# EAGLE design quant_v1_oshpark (EAGLE 9.0.0)
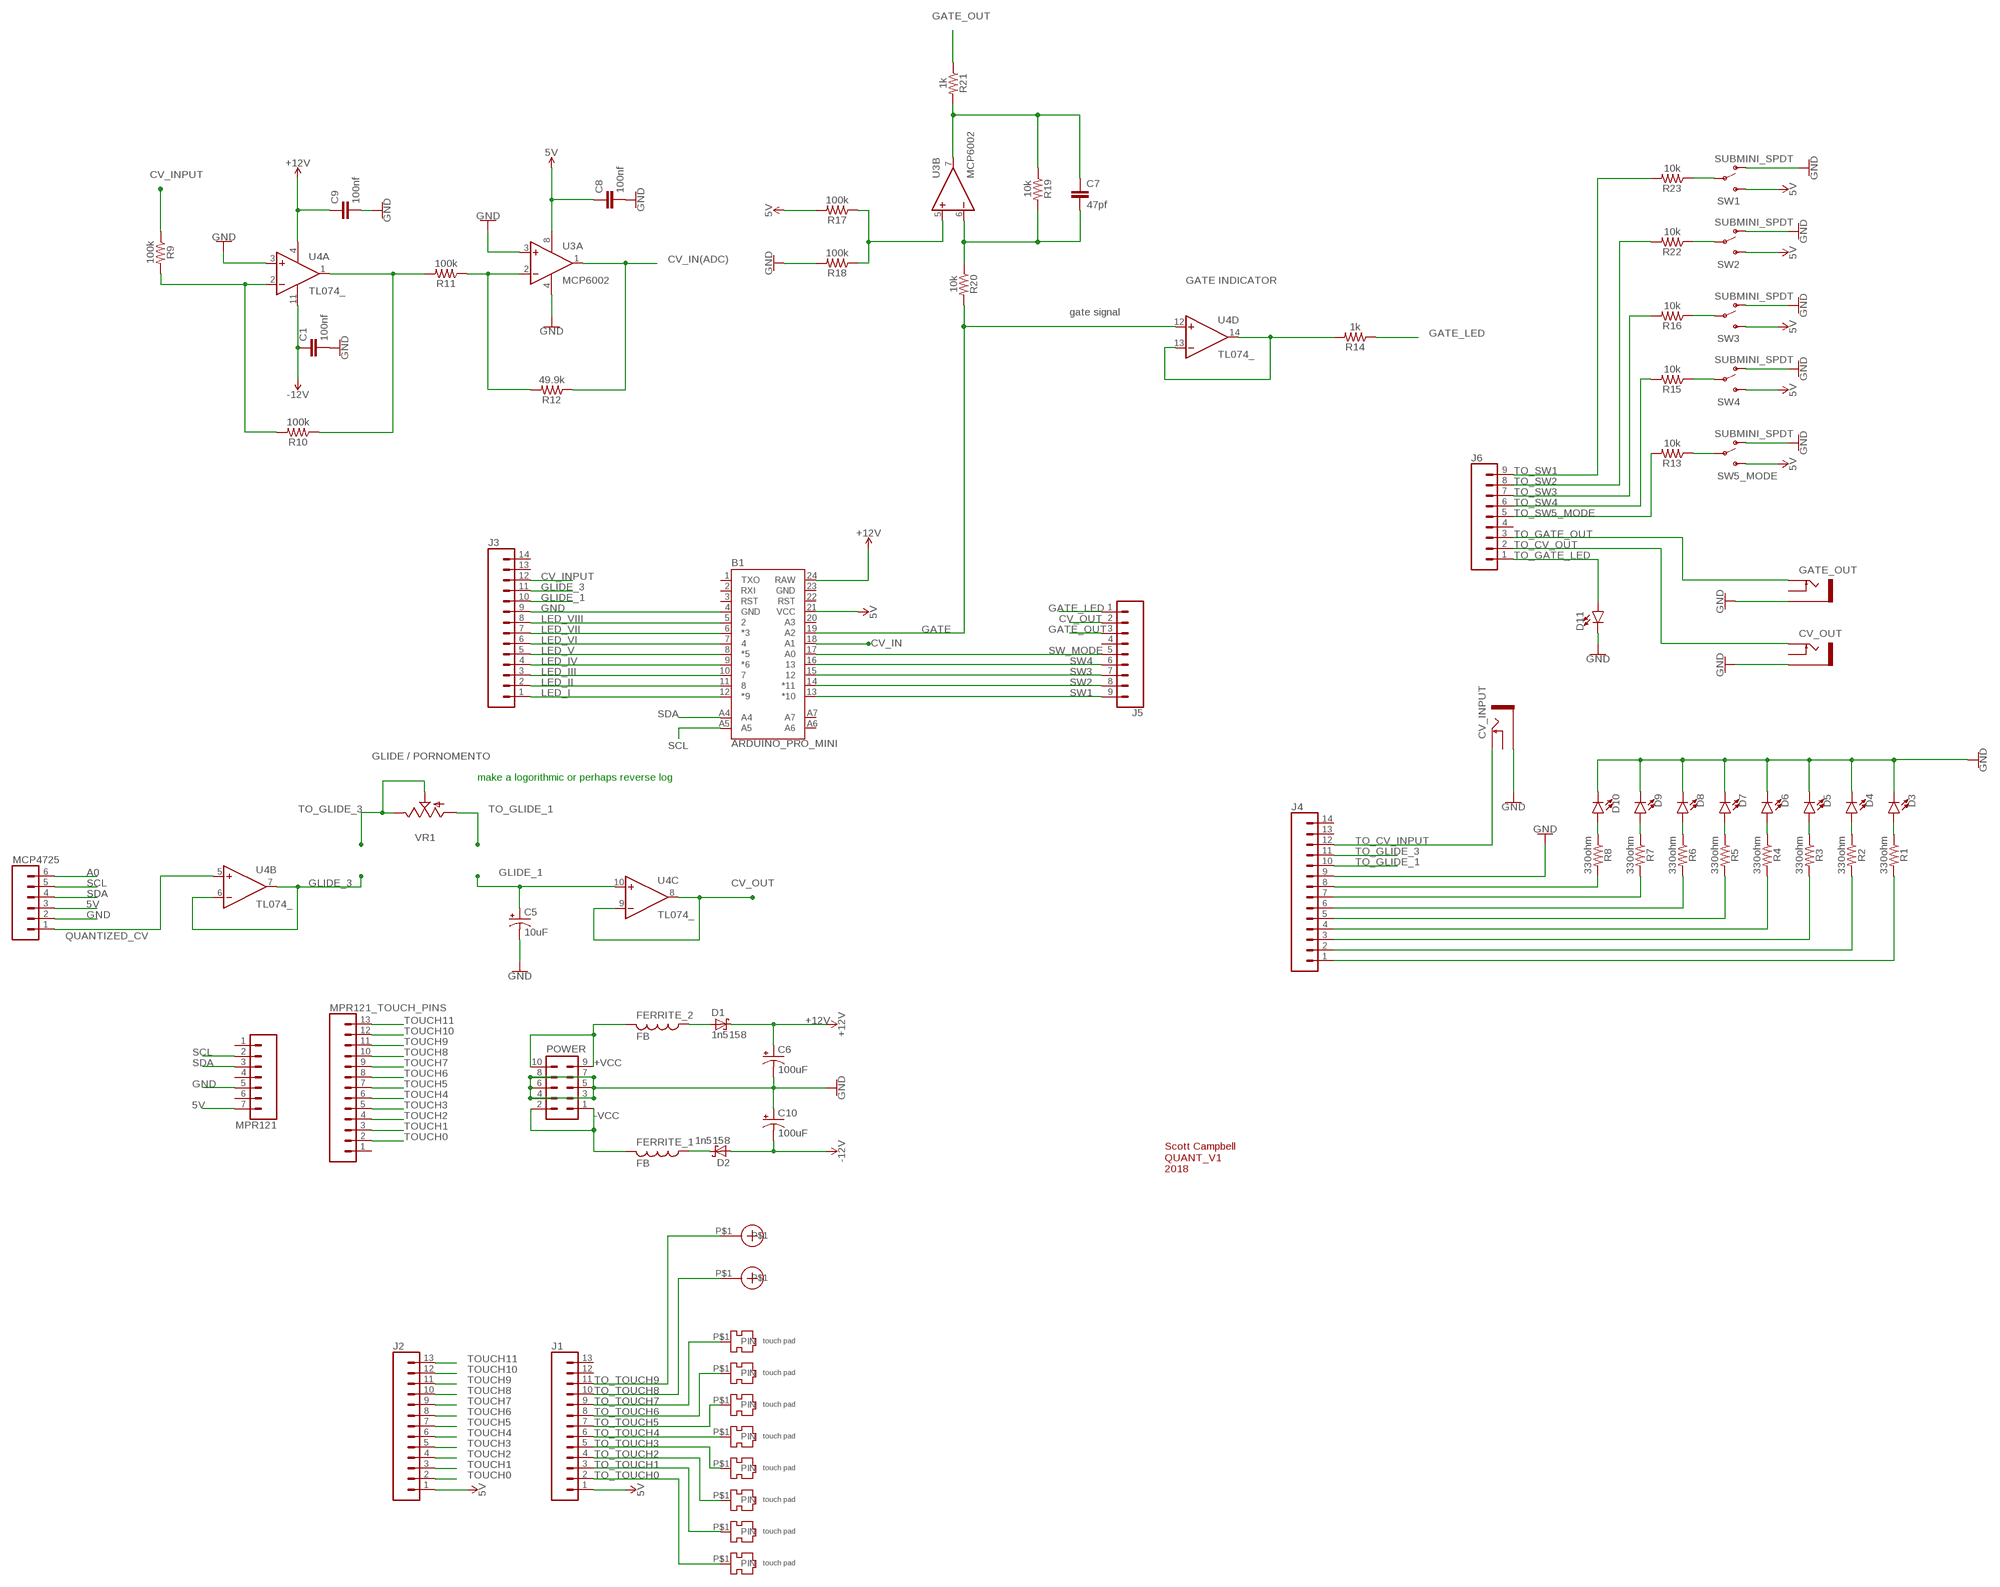
[diagram p0: schematic, sheet 1]

## Parts
B1  ARDUINO_PRO_MINI  [ARDUINO_PRO_MINI]
C1  100nf  C2.5/5  [C2.5-5]
C5  10uF  10UF-POLAR-RADIAL-2.5MM-25V-20%  [CPOL-RADIAL-2.5MM-5MM]
C6  100uF  100UF-POLAR-RADIAL-2.5MM-25V-20%  [CPOL-RADIAL-2.5MM-6.5MM]
C7  47pf  C2.5/5  [C2.5-5]
C8  100nf  C2,5-3  [C2.5-3]
C9  100nf  C2.5/5  [C2.5-5]
C10  100uF  100UF-POLAR-RADIAL-2.5MM-25V-20%  [CPOL-RADIAL-2.5MM-6.5MM]
CV_INPUT  THONKICONNNEW  [WQP-PJ301M-12_JACK]
CV_OUT  CV_OUT  THONKICONNNEW  [WQP-PJ301M-12_JACK]
D1  1n5158  SCHOTTKY-DIODEDO41  [DO41-10]
D2  1n5158  SCHOTTKY-DIODEDO41  [DO41-10]
D3  LED3MM  [LED_3MM]
D4  LED3MM  [LED_3MM]
D5  LED3MM  [LED_3MM]
D6  LED3MM  [LED_3MM]
D7  LED3MM  [LED_3MM]
D8  LED3MM  [LED_3MM]
D9  LED3MM  [LED_3MM]
D10  LED3MM  [LED_3MM]
D11  LED3MM  [LED_3MM]
FERRITE_1  FB  [FB]
FERRITE_2  FB  [FB]
GATE_OUT  GATE_OUT  THONKICONNNEW  [WQP-PJ301M-12_JACK]
J1  CONN_13  [1X13]
J2  CONN_13  [1X13]
J3  CONN_14  [1X14]
J4  CONN_14  [1X14]
J5  CONN_09  [1X09]
J6  CONN_09  [1X09]
MCP4725  CONN_06NO_SILK_FEMALE_PTH  [1X06_NO_SILK]
MPR121  CONN_07  [1X07]
MPR121_TOUCH_PINS  CONN_13  [1X13]
POWER  EURO_POWER_HEADERREGULAR  [EURO_POWER_HEADER]
R1  330ohm  1KOHM-HORIZ-1/4W-5%  [AXIAL-0.3]
R2  330ohm  1KOHM-HORIZ-1/4W-5%  [AXIAL-0.3]
R3  330ohm  1KOHM-HORIZ-1/4W-5%  [AXIAL-0.3]
R4  330ohm  1KOHM-HORIZ-1/4W-5%  [AXIAL-0.3]
R5  330ohm  1KOHM-HORIZ-1/4W-5%  [AXIAL-0.3]
R6  330ohm  1KOHM-HORIZ-1/4W-5%  [AXIAL-0.3]
R7  330ohm  1KOHM-HORIZ-1/4W-5%  [AXIAL-0.3]
R8  330ohm  1KOHM-HORIZ-1/4W-5%  [AXIAL-0.3]
R9  100k  1KOHM-HORIZ-1/4W-5%  [AXIAL-0.3]
R10  100k  1KOHM-HORIZ-1/4W-5%  [AXIAL-0.3]
R11  100k  1KOHM-HORIZ-1/4W-5%  [AXIAL-0.3]
R12  49.9k  1KOHM-HORIZ-1/4W-5%  [AXIAL-0.3]
R13  10k  1KOHM-HORIZ-1/4W-5%  [AXIAL-0.3]
R14  1k  1KOHM-HORIZ-1/4W-5%  [AXIAL-0.3]
R15  10k  1KOHM-HORIZ-1/4W-5%  [AXIAL-0.3]
R16  10k  1KOHM-HORIZ-1/4W-5%  [AXIAL-0.3]
R17  100k  1KOHM-HORIZ-1/4W-5%  [AXIAL-0.3]
R18  100k  1KOHM-HORIZ-1/4W-5%  [AXIAL-0.3]
R19  10k  1KOHM-HORIZ-1/4W-5%  [AXIAL-0.3]
R20  10k  1KOHM-HORIZ-1/4W-5%  [AXIAL-0.3]
R21  1k  1KOHM-HORIZ-1/4W-5%  [AXIAL-0.3]
R22  10k  1KOHM-HORIZ-1/4W-5%  [AXIAL-0.3]
R23  10k  1KOHM-HORIZ-1/4W-5%  [AXIAL-0.3]
SW1  SUBMINI_SPDT  [SUBMINI_TOGGLE]
SW2  SUBMINI_SPDT  [SUBMINI_TOGGLE]
SW3  SUBMINI_SPDT  [SUBMINI_TOGGLE]
SW4  SUBMINI_SPDT  [SUBMINI_TOGGLE]
SW5_MODE  SUBMINI_SPDT  [SUBMINI_TOGGLE]
TOUCH_1  TOUCH_PAD_ESSY  [TOUCH_PAD_ESSY]
TOUCH_2  TOUCH_PAD_ESSY  [TOUCH_PAD_ESSY]
TOUCH_3  TOUCH_PAD_ESSY  [TOUCH_PAD_ESSY]
TOUCH_4  TOUCH_PAD_ESSY  [TOUCH_PAD_ESSY]
TOUCH_5  TOUCH_PAD_ESSY  [TOUCH_PAD_ESSY]
TOUCH_6  TOUCH_PAD_ESSY  [TOUCH_PAD_ESSY]
TOUCH_7  TOUCH_PAD_ESSY  [TOUCH_PAD_ESSY]
TOUCH_8  TOUCH_PAD_ESSY  [TOUCH_PAD_ESSY]
U3  MCP6002  TL072_  [DIL08]
U4  TL074_  [DIL14]
U$1  TOUCH_PAD_INCREMENT  [TOUCH_PAD_INCREMENT]
U$2  TOUCH_PAD_INCREMENT  [TOUCH_PAD_INCREMENT]
VR1  9MM_SNAP-IN_POT_  [9MM_SNAP-IN_POT]

## Nets
5V: B1.21(VCC) C8.1 J1.1 J2.1 MCP4725.3 MPR121.7 R17.P$2 SW1.3(S) SW2.3(S) SW3.3(S) SW4.3(S) U3.8(P:V+)
+12V: B1.24(RAW) C6.1(+) C9.1 D1.C U4.4(P:V+)
+VCC: FERRITE_2.P$2 POWER.9 POWER.10
-12V: C1.1 C10.2(-) D2.A U4.11(P:V-)
-VCC: FERRITE_1.P$2 POWER.1 POWER.2
A0: MCP4725.6
CV_IN: B1.18(A1) R12.P$1 U3.1(A:OUT)
CV_INPUT: J3.12 R9.P$1
CV_OUT: J5.2 U4.8(C:OUT) U4.9(C:-IN)
GATE: B1.19(A2) R20.P$2 U4.12(D:+IN)
GATE_LED: J5.1 R14.P$1
GATE_OUT: J5.3 R21.P$1
GLIDE_1: C5.1(+) J3.10 U4.10(C:+IN)
GLIDE_3: J3.11 U4.6(B:-IN) U4.7(B:OUT)
GND: B1.4(GND) C1.2 C5.2(-) C6.2(-) C8.2 C9.2 C10.1(+) CV_INPUT.P$3_SLEEVE(SLEEVE) CV_OUT.P$3_SLEEVE(SLEEVE) D3.K(C) D4.K(C) D5.K(C) D6.K(C) D7.K(C) D8.K(C) D9.K(C) D10.K(C) D11.K(C) GATE_OUT.P$3_SLEEVE(SLEEVE) J3.9 J4.9 MCP4725.2 MPR121.5 POWER.3 POWER.4 POWER.5 POWER.6 POWER.7 POWER.8 R18.P$2 SW1.1(O) SW2.1(O) SW3.1(O) SW4.1(O) SW5_MODE.1(O) U3.3(A:+IN) U3.4(P:V-) U4.3(A:+IN)
LED_I: B1.12(*9) J3.1
LED_II: B1.11 J3.2
LED_III: B1.10 J3.3
LED_IV: B1.9(*6) J3.4
LED_V: B1.8(*5) J3.5
LED_VI: B1.7 J3.6
LED_VII: B1.6(*3) J3.7
LED_VIII: B1.5 J3.8
N$1: D2.C FERRITE_1.P$1
N$2: C7.1 R19.P$1 R21.P$2 U3.7(B:OUT)
N$3: D1.A FERRITE_2.P$1
N$4: R23.P$1 SW1.COM(COMMON)
N$5: D3.A R1.P$1
N$6: R22.P$1 SW2.COM(COMMON)
N$7: R16.P$1 SW3.COM(COMMON)
N$8: R15.P$1 SW4.COM(COMMON)
N$10: R14.P$2 U4.13(D:-IN) U4.14(D:OUT)
N$13: D10.A R8.P$1
N$14: D9.A R7.P$1
N$15: D8.A R6.P$1
N$16: D7.A R5.P$1
N$17: D6.A R4.P$1
N$18: D5.A R3.P$1
N$19: D4.A R2.P$1
N$20: C7.2 R19.P$2 R20.P$1 U3.6(B:-IN)
N$24: R9.P$2 R10.P$2 U4.2(A:-IN)
N$27: R13.P$1 SW5_MODE.COM(COMMON)
N$28: R10.P$1 R11.P$2 U4.1(A:OUT)
N$29: R11.P$1 R12.P$2 U3.2(A:-IN)
N$30: R17.P$1 R18.P$1 U3.5(B:+IN)
N$32: J4.8 R8.P$2
N$33: J4.7 R7.P$2
N$35: J4.6 R6.P$2
N$36: J4.5 R5.P$2
N$40: J4.4 R4.P$2
N$41: J4.3 R3.P$2
N$42: J4.2 R2.P$2
N$43: J4.1 R1.P$2
QUANTIZED_CV: MCP4725.1 U4.5(B:+IN)
SCL: B1.A5 MCP4725.5 MPR121.2
SDA: B1.A4 MCP4725.4 MPR121.3
SW1: B1.13(*10) J5.9
SW2: B1.14(*11) J5.8
SW3: B1.15 J5.7
SW4: B1.16 J5.6
SW_MODE: B1.17(A0) J5.5
TO_CV_INPUT: CV_INPUT.P$1_TIP(TIP) J4.12
TO_CV_OUT: CV_OUT.P$1_TIP(TIP) J6.2
TO_GATE_LED: D11.A J6.1
TO_GATE_OUT: GATE_OUT.P$1_TIP(TIP) J6.3
TO_GLIDE_1: J4.10 VR1.1(A)
TO_GLIDE_3: J4.11 VR1.2(S) VR1.3(E)
TO_SW1: J6.9 R23.P$2
TO_SW2: J6.8 R22.P$2
TO_SW3: J6.7 R16.P$2
TO_SW4: J6.6 R15.P$2
TO_SW5_MODE: J6.5 R13.P$2
TO_TOUCH0: J1.2 TOUCH_8.P$1(PIN)
TO_TOUCH1: J1.3 TOUCH_7.P$1(PIN)
TO_TOUCH2: J1.4 TOUCH_6.P$1(PIN)
TO_TOUCH3: J1.5 TOUCH_5.P$1(PIN)
TO_TOUCH4: J1.6 TOUCH_4.P$1(PIN)
TO_TOUCH5: J1.7 TOUCH_3.P$1(PIN)
TO_TOUCH6: J1.8 TOUCH_2.P$1(PIN)
TO_TOUCH7: J1.9 TOUCH_1.P$1(PIN)
TO_TOUCH8: J1.10 U$2.P$1
TO_TOUCH9: J1.11 U$1.P$1
TOUCH0: J2.2 MPR121_TOUCH_PINS.2
TOUCH1: J2.3 MPR121_TOUCH_PINS.3
TOUCH2: J2.4 MPR121_TOUCH_PINS.4
TOUCH3: J2.5 MPR121_TOUCH_PINS.5
TOUCH4: J2.6 MPR121_TOUCH_PINS.6
TOUCH5: J2.7 MPR121_TOUCH_PINS.7
TOUCH6: J2.8 MPR121_TOUCH_PINS.8
TOUCH7: J2.9 MPR121_TOUCH_PINS.9
TOUCH8: J2.10 MPR121_TOUCH_PINS.10
TOUCH9: J2.11 MPR121_TOUCH_PINS.11
TOUCH10: J2.12 MPR121_TOUCH_PINS.12
TOUCH11: J2.13 MPR121_TOUCH_PINS.13
Unconnected: B1.1(TXO) B1.2(RXI) B1.3(RST) B1.20(A3) B1.22(RST) B1.A6 B1.A7 CV_INPUT.P$2_SWITCH(SWITCH) CV_OUT.P$2_SWITCH(SWITCH) GATE_OUT.P$2_SWITCH(SWITCH) J1.12 J1.13 J3.13 J3.14 J4.13 J4.14 J5.4 J6.4 MPR121.1 MPR121.4 MPR121.6 MPR121_TOUCH_PINS.1 SW5_MODE.3(S)

## Notes on the sheet
- (ADC)
- GATE INDICATOR
- gate signal
- GLIDE / PORNOMENTO
- make a logorithmic or perhaps reverse log
- Scott Campbell
  QUANT_V1
  2018

## Power pins joined to a net without a drawn wire
GND: B1.23(GND)

## Library data of the parts
B1 = SparkFun-Boards:ARDUINO_PRO_MINI: SparkFun Pro Mini Pro Mini compatible footprint. Dimensions: 0.7 x 1.3" PCB Thickness: 0.8mm SparkFun Products: 3.3V/8MHz <https://www.sparkfun.com/products/11114> 5V/16MHz <https://www.sparkfun.com/products/11113>
C1 C7-C9 = capacitor-wima:C: CAPACITOR naming: grid - package width
C5 = SparkFun-Capacitors:10UF-POLAR: 10.0µF polarized capacitors A capacitor is a passive two-terminal electrical component used to store electrical energy temporarily in an electric field.; PROD_ID: CAP-08440
C6 C10 = SparkFun-Capacitors:100UF-POLAR: 100µF polarized capacitors A capacitor is a passive two-terminal electrical component used to store electrical energy temporarily in an electric field.; PROD_ID: CAP-08439
CV_INPUT CV_OUT GATE_OUT = MusicThingModular:THONKICONN: 3.5mm socket for Eurorack modular synths
D1 D2 = adafruit:SCHOTTKY-DIODE: Schottky Diode
D3-D11 = SparkFun-LED:LED: LED (Generic) Standard schematic elements and footprints for 5mm, 3mm, 1206, and 0603 sized LEDs. Generic LEDs with no color specified.; PROD_ID: DIO-08794
FERRITE_1 FERRITE_2 = adafruit:FB: Ferrite bead Digikey #P9821BK-ND
J1 J2 = SparkFun-Connectors:CONN_13: Multi connection point. Often used as Generic Header-pin footprint for 0.1 inch spaced/style header connections On any of the 0.1 inch spaced packages, you can populate with these: Break Away Headers - Straight <https://www.sparkfun.com/products/116> (PRT-00116) Break Away Male Headers - Right Angle <https://www.sparkfun.com/products/553> (PRT-00553) Female Headers <https://www.sparkfun.com/products/115> (PRT-00115) Break Away Headers - Machine Pin <https://www.sparkfun.com/products/117> (PRT-00117) Break Away Female Headers - Swiss Machine Pin <https://www.sparkfun.com/products/743> (PRT-00743) For SCREWTERMINALS and SPRING TERMINALS visit here: Screw Terimnals on SparkFun.com <https://www.sparkfun.com/search/results?term=Screw+Terminals> (5mm/3.5mm/2.54mm spacing) This device is also useful as a general connection point to wire up your design to another part of your project. Our various solder wires solder well into these plated through hole pads. Hook-Up Wire - Assortment (Stranded, 22 AWG) <https://www.sparkfun.com/products/11375> (PRT-11375) Hook-Up Wire - Assortment (Solid Core, 22 AWG) <https://www.sparkfun.com/products/11367> (PRT-11367) View the entire wire category on our website here <https://www.sparkfun.com/categories/141> Special notes: Molex polarized connector foot print use with SKU : PRT-08231 with associated crimp pins and housings. 1MM SMD Version SKU: PRT-10208 NOTES ON THE VARIANTS LOCK and LOCK_LONGPADS... This footprint was designed to help hold the alignment of a through-hole component (i.e. 6-pin header) while soldering it into place. You may notice that each hole has been shifted either up or down by 0.005 of an inch from it's more standard position (which is a perfectly straight line). This slight alteration caused the pins (the squares in the middle) to touch the edges of the holes. Because they are alternating, it causes a "brace" to hold the component in place. 0.005 has proven to be the perfect amount of "off-center" position when using our standard breakaway headers. Although looks a little odd when you look at the bare footprint, once you have a header in there, the alteration is very hard to notice. Also,if you push a header all the way into place, it is covered up entirely on the bottom side.; SPICEPREFIX: X
J3 J4 = SparkFun-Connectors:CONN_14: Multi connection point. Often used as Generic Header-pin footprint for 0.1 inch spaced/style header connections On any of the 0.1 inch spaced packages, you can populate with these: Break Away Headers - Straight <https://www.sparkfun.com/products/116> (PRT-00116) Break Away Male Headers - Right Angle <https://www.sparkfun.com/products/553> (PRT-00553) Female Headers <https://www.sparkfun.com/products/115> (PRT-00115) Break Away Headers - Machine Pin <https://www.sparkfun.com/products/117> (PRT-00117) Break Away Female Headers - Swiss Machine Pin <https://www.sparkfun.com/products/743> (PRT-00743) For SCREWTERMINALS and SPRING TERMINALS visit here: Screw Terimnals on SparkFun.com <https://www.sparkfun.com/search/results?term=Screw+Terminals> (5mm/3.5mm/2.54mm spacing) This device is also useful as a general connection point to wire up your design to another part of your project. Our various solder wires solder well into these plated through hole pads. Hook-Up Wire - Assortment (Stranded, 22 AWG) <https://www.sparkfun.com/products/11375> (PRT-11375) Hook-Up Wire - Assortment (Solid Core, 22 AWG) <https://www.sparkfun.com/products/11367> (PRT-11367) View the entire wire category on our website here <https://www.sparkfun.com/categories/141> Special notes: Molex polarized connector foot print use with SKU : PRT-08231 with associated crimp pins and housings. 1MM SMD Version SKU: PRT-10208 NOTES ON THE VARIANTS LOCK and LOCK_LONGPADS... This footprint was designed to help hold the alignment of a through-hole component (i.e. 6-pin header) while soldering it into place. You may notice that each hole has been shifted either up or down by 0.005 of an inch from it's more standard position (which is a perfectly straight line). This slight alteration caused the pins (the squares in the middle) to touch the edges of the holes. Because they are alternating, it causes a "brace" to hold the component in place. 0.005 has proven to be the perfect amount of "off-center" position when using our standard breakaway headers. Although looks a little odd when you look at the bare footprint, once you have a header in there, the alteration is very hard to notice. Also,if you push a header all the way into place, it is covered up entirely on the bottom side.
J5 J6 = SparkFun-Connectors:CONN_09: Multi connection point. Often used as Generic Header-pin footprint for 0.1 inch spaced/style header connections On any of the 0.1 inch spaced packages, you can populate with these: Break Away Headers - Straight <https://www.sparkfun.com/products/116> (PRT-00116) Break Away Male Headers - Right Angle <https://www.sparkfun.com/products/553> (PRT-00553) Female Headers <https://www.sparkfun.com/products/115> (PRT-00115) Break Away Headers - Machine Pin <https://www.sparkfun.com/products/117> (PRT-00117) Break Away Female Headers - Swiss Machine Pin <https://www.sparkfun.com/products/743> (PRT-00743) For SCREWTERMINALS and SPRING TERMINALS visit here: Screw Terimnals on SparkFun.com <https://www.sparkfun.com/search/results?term=Screw+Terminals> (5mm/3.5mm/2.54mm spacing) This device is also useful as a general connection point to wire up your design to another part of your project. Our various solder wires solder well into these plated through hole pads. Hook-Up Wire - Assortment (Stranded, 22 AWG) <https://www.sparkfun.com/products/11375> (PRT-11375) Hook-Up Wire - Assortment (Solid Core, 22 AWG) <https://www.sparkfun.com/products/11367> (PRT-11367) View the entire wire category on our website here <https://www.sparkfun.com/categories/141> Special notes: Molex polarized connector foot print use with SKU : PRT-08231 with associated crimp pins and housings. 1MM SMD Version SKU: PRT-10208 NOTES ON THE VARIANTS LOCK and LOCK_LONGPADS... This footprint was designed to help hold the alignment of a through-hole component (i.e. 6-pin header) while soldering it into place. You may notice that each hole has been shifted either up or down by 0.005 of an inch from it's more standard position (which is a perfectly straight line). This slight alteration caused the pins (the squares in the middle) to touch the edges of the holes. Because they are alternating, it causes a "brace" to hold the component in place. 0.005 has proven to be the perfect amount of "off-center" position when using our standard breakaway headers. Although looks a little odd when you look at the bare footprint, once you have a header in there, the alteration is very hard to notice. Also,if you push a header all the way into place, it is covered up entirely on the bottom side.
MCP4725 = SparkFun-Connectors:CONN_06: Multi connection point. Often used as Generic Header-pin footprint for 0.1 inch spaced/style header connections On any of the 0.1 inch spaced packages, you can populate with these: Break Away Headers - Straight <https://www.sparkfun.com/products/116> (PRT-00116) Break Away Male Headers - Right Angle <https://www.sparkfun.com/products/553> (PRT-00553) Female Headers <https://www.sparkfun.com/products/115> (PRT-00115) Break Away Headers - Machine Pin <https://www.sparkfun.com/products/117> (PRT-00117) Break Away Female Headers - Swiss Machine Pin <https://www.sparkfun.com/products/743> (PRT-00743) Arduino Stackable Header - 6 Pin <https://www.sparkfun.com/products/9280> (PRT-09280) For SCREWTERMINALS and SPRING TERMINALS visit here: Screw Terimnals on SparkFun.com <https://www.sparkfun.com/search/results?term=Screw+Terminals> (5mm/3.5mm/2.54mm spacing) This device is also useful as a general connection point to wire up your design to another part of your project. Our various solder wires solder well into these plated through hole pads. Hook-Up Wire - Assortment (Stranded, 22 AWG) <https://www.sparkfun.com/products/11375> (PRT-11375) Hook-Up Wire - Assortment (Solid Core, 22 AWG) <https://www.sparkfun.com/products/11367> (PRT-11367) View the entire wire category on our website here <https://www.sparkfun.com/categories/141>; PROD_ID: CONN-08437
MPR121 = SparkFun-Connectors:CONN_07: Multi connection point. Often used as Generic Header-pin footprint for 0.1 inch spaced/style header connections On any of the 0.1 inch spaced packages, you can populate with these: Break Away Headers - Straight <https://www.sparkfun.com/products/116> (PRT-00116) Break Away Male Headers - Right Angle <https://www.sparkfun.com/products/553> (PRT-00553) Female Headers <https://www.sparkfun.com/products/115> (PRT-00115) Break Away Headers - Machine Pin <https://www.sparkfun.com/products/117> (PRT-00117) Break Away Female Headers - Swiss Machine Pin <https://www.sparkfun.com/products/743> (PRT-00743) For SCREWTERMINALS and SPRING TERMINALS visit here: Screw Terimnals on SparkFun.com <https://www.sparkfun.com/search/results?term=Screw+Terminals> (5mm/3.5mm/2.54mm spacing) This device is also useful as a general connection point to wire up your design to another part of your project. Our various solder wires solder well into these plated through hole pads. Hook-Up Wire - Assortment (Stranded, 22 AWG) <https://www.sparkfun.com/products/11375> (PRT-11375) Hook-Up Wire - Assortment (Solid Core, 22 AWG) <https://www.sparkfun.com/products/11367> (PRT-11367) View the entire wire category on our website here <https://www.sparkfun.com/categories/141> Special notes: Molex polarized connector foot print use with SKU : PRT-08231 with associated crimp pins and housings. 1MM SMD Version SKU: PRT-10208 NOTES ON THE VARIANTS LOCK and LOCK_LONGPADS... This footprint was designed to help hold the alignment of a through-hole component (i.e. 6-pin header) while soldering it into place. You may notice that each hole has been shifted either up or down by 0.005 of an inch from it's more standard position (which is a perfectly straight line). This slight alteration caused the pins (the squares in the middle) to touch the edges of the holes. Because they are alternating, it causes a "brace" to hold the component in place. 0.005 has proven to be the perfect amount of "off-center" position when using our standard breakaway headers. Although looks a little odd when you look at the bare footprint, once you have a header in there, the alteration is very hard to notice. Also,if you push a header all the way into place, it is covered up entirely on the bottom side.
MPR121_TOUCH_PINS = SparkFun-Connectors:CONN_13: Multi connection point. Often used as Generic Header-pin footprint for 0.1 inch spaced/style header connections On any of the 0.1 inch spaced packages, you can populate with these: Break Away Headers - Straight <https://www.sparkfun.com/products/116> (PRT-00116) Break Away Male Headers - Right Angle <https://www.sparkfun.com/products/553> (PRT-00553) Female Headers <https://www.sparkfun.com/products/115> (PRT-00115) Break Away Headers - Machine Pin <https://www.sparkfun.com/products/117> (PRT-00117) Break Away Female Headers - Swiss Machine Pin <https://www.sparkfun.com/products/743> (PRT-00743) For SCREWTERMINALS and SPRING TERMINALS visit here: Screw Terimnals on SparkFun.com <https://www.sparkfun.com/search/results?term=Screw+Terminals> (5mm/3.5mm/2.54mm spacing) This device is also useful as a general connection point to wire up your design to another part of your project. Our various solder wires solder well into these plated through hole pads. Hook-Up Wire - Assortment (Stranded, 22 AWG) <https://www.sparkfun.com/products/11375> (PRT-11375) Hook-Up Wire - Assortment (Solid Core, 22 AWG) <https://www.sparkfun.com/products/11367> (PRT-11367) View the entire wire category on our website here <https://www.sparkfun.com/categories/141> Special notes: Molex polarized connector foot print use with SKU : PRT-08231 with associated crimp pins and housings. 1MM SMD Version SKU: PRT-10208 NOTES ON THE VARIANTS LOCK and LOCK_LONGPADS... This footprint was designed to help hold the alignment of a through-hole component (i.e. 6-pin header) while soldering it into place. You may notice that each hole has been shifted either up or down by 0.005 of an inch from it's more standard position (which is a perfectly straight line). This slight alteration caused the pins (the squares in the middle) to touch the edges of the holes. Because they are alternating, it causes a "brace" to hold the component in place. 0.005 has proven to be the perfect amount of "off-center" position when using our standard breakaway headers. Although looks a little odd when you look at the bare footprint, once you have a header in there, the alteration is very hard to notice. Also,if you push a header all the way into place, it is covered up entirely on the bottom side.
POWER = MusicThingModular:EURO_POWER_HEADER: Power Header 10 pin power header for Eurorack Power Supplies Variants with fatter pads for easier soldering, and the LOCK variant which has 5mil offset pins to hold the component in place before soldering
R1-R13 R15-R20 R22 R23 = SparkFun-Resistors:1KOHM: 1kΩ resistor A resistor is a passive two-terminal electrical component that implements electrical resistance as a circuit element. Resistors act to reduce current flow, and, at the same time, act to lower voltage levels within circuits. - Wikipedia; PROD_ID: RES-08380; VALUE: 1k
R14 R21 = SparkFun-Resistors:1KOHM: 1kΩ resistor A resistor is a passive two-terminal electrical component that implements electrical resistance as a circuit element. Resistors act to reduce current flow, and, at the same time, act to lower voltage levels within circuits. - Wikipedia; PROD_ID: RES-08380
SW1-SW4 SW5_MODE = MusicThingModular:SUBMINI_SPDT
TOUCH_1-TOUCH_8 = ESSY:TOUCH_PAD_ESSY
U3 = MusicThingModular:TL072: Generic Dual Op Amp
U4 = MusicThingModular:TL074: Generic Quad Op Amp
U$1 U$2 = ESSY:TOUCH_PAD_INCREMENT
VR1 = MusicThingModular:9MM_SNAP-IN_POT: 9mm vertical snap-in pot, Alpha / Panasonic style

## Board
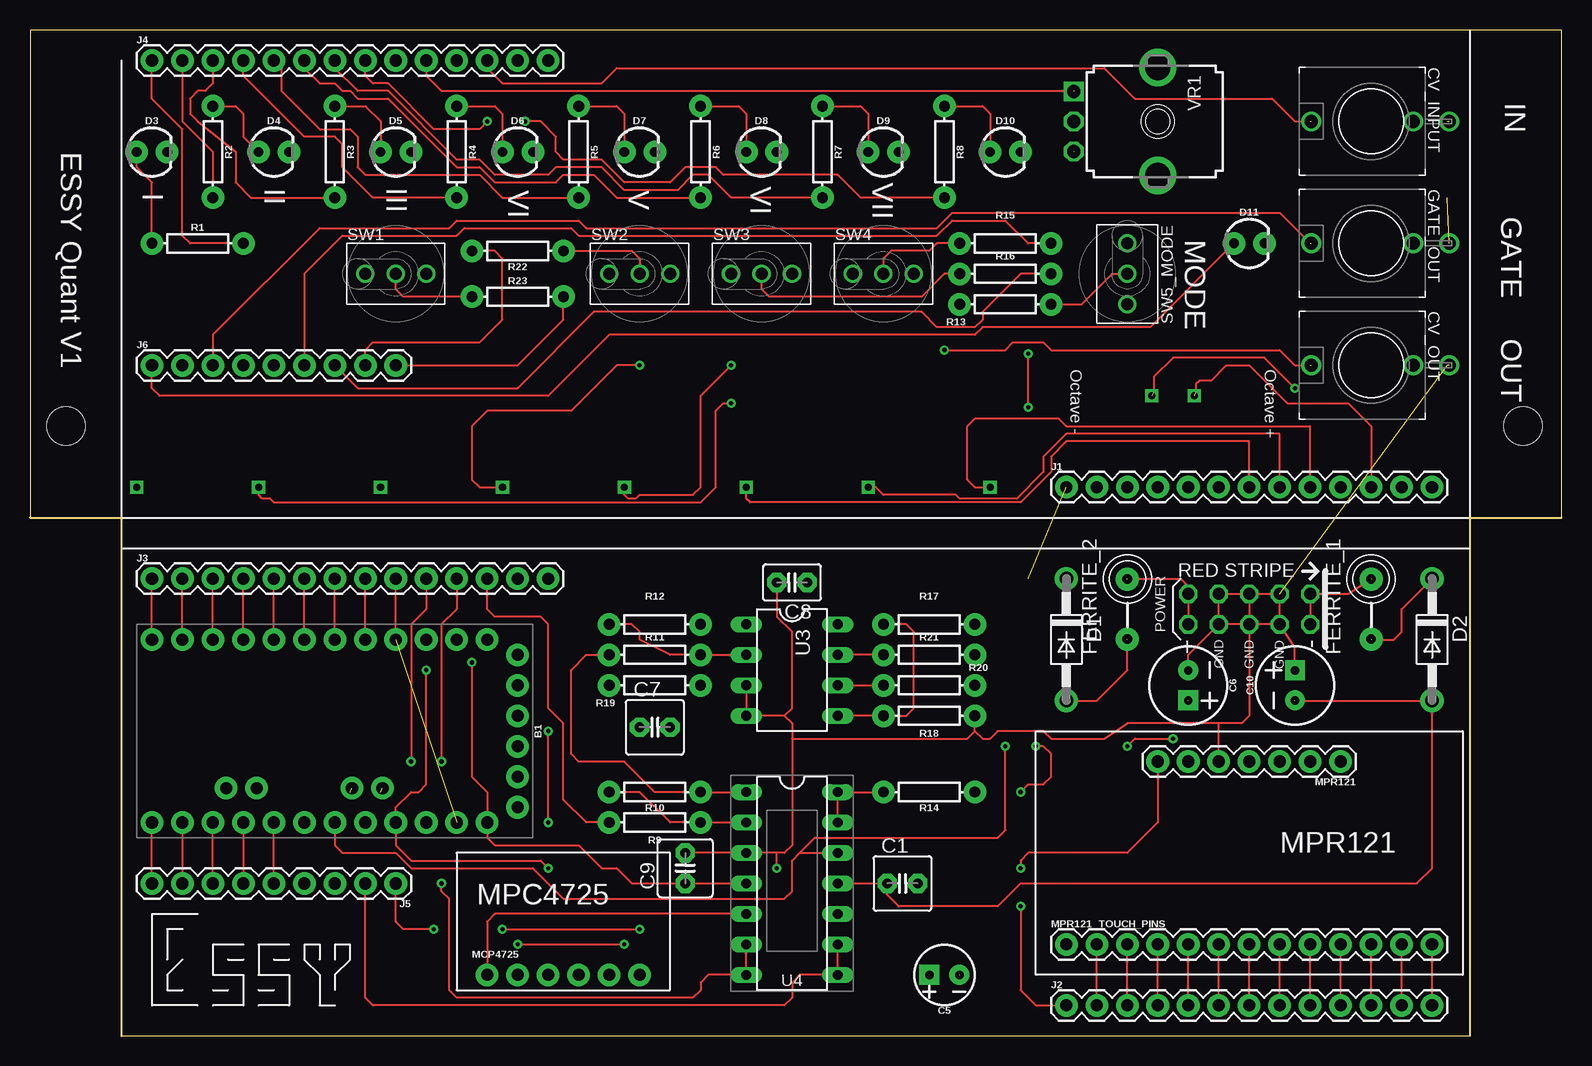
[diagram p1: board, top side]
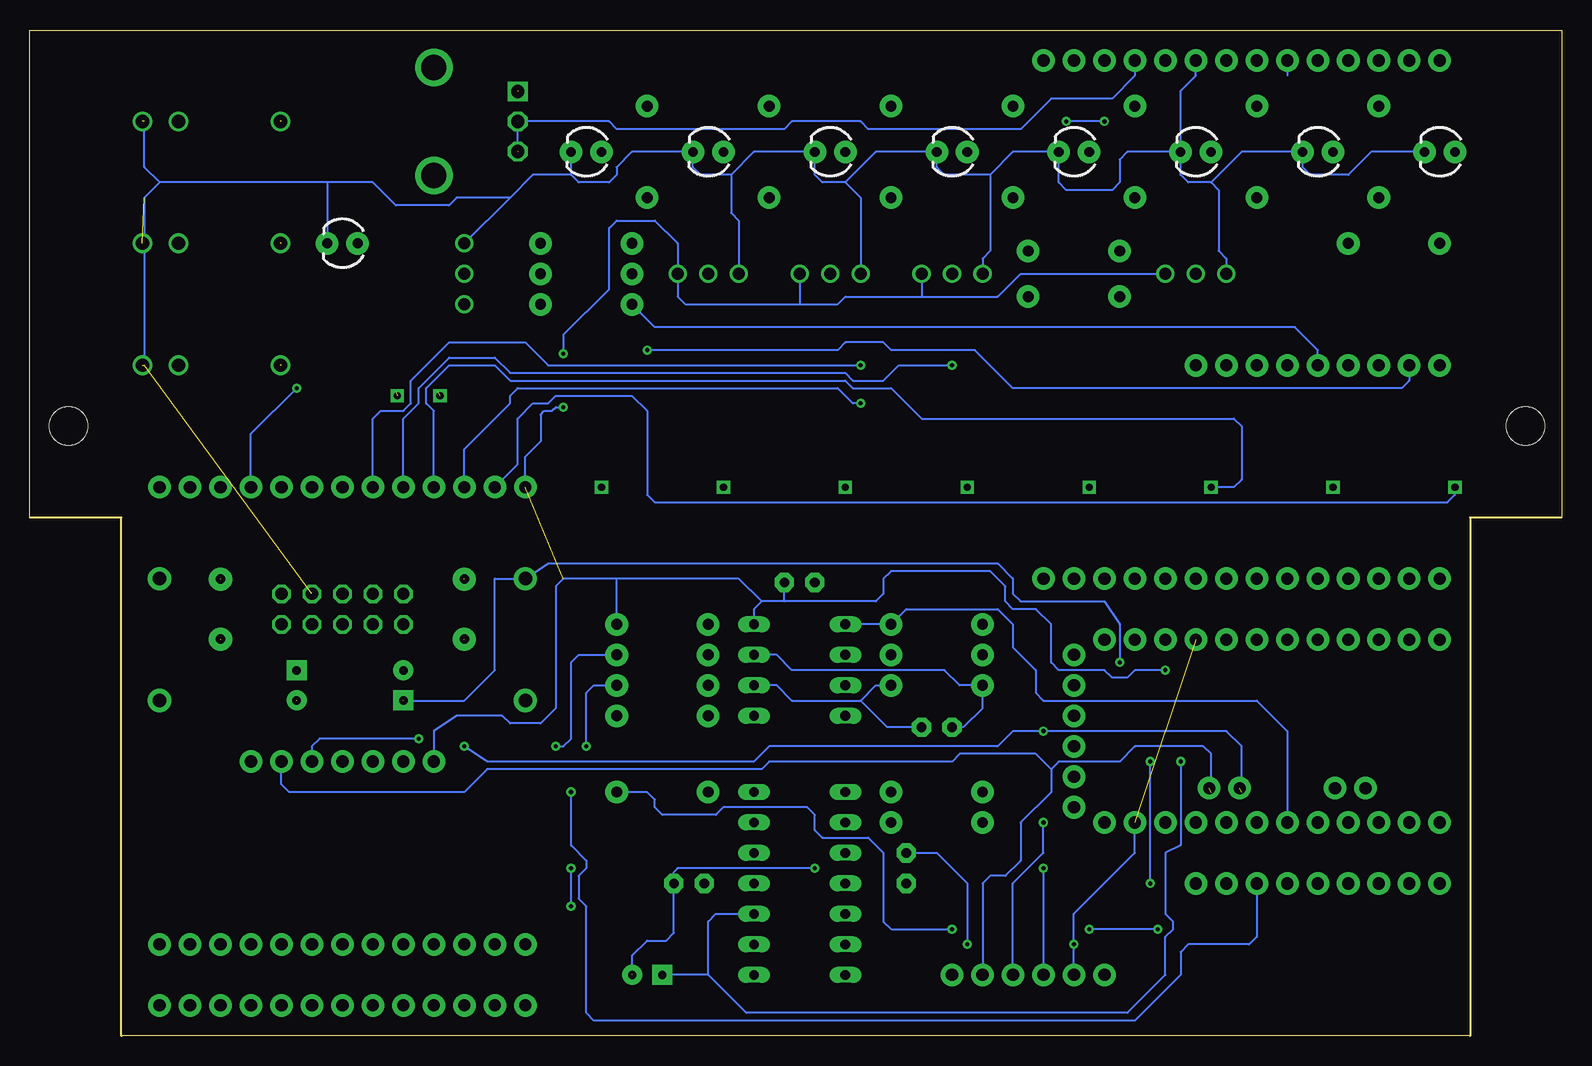
[diagram p2: board, bottom side, seen from below]

Size 127.64 x 83.82 mm. Coordinates in mm from the lower left corner, seen from the top.
Outline: 7.62,0 120.02,0 120.02,43.18 127.64,43.18 127.64,83.82 0,83.81 0,43.18 7.62,43.18 7.62,0
Copper layers (1*16): Top 0.035mm / dielectric 1.5mm / Bottom 0.035mm
Design rules "default": minimum track width 6mil, minimum drill 0.35mm, track to track 6mil, track to pad 6mil, pad to pad 6mil, via to via 6mil, smd to smd 6mil, copper to edge 40mil, drill to drill 6mil, minimum pad ring 10mil, minimum via ring 8mil, stop-mask expansion 4mil, vias tented up to drill 0mil, thermal gap 10mil

### Footprints (pad centres in the part's own frame; a part is rotated, then mirrored left to right if it is on the bottom)
ARDUINO_PRO_MINI = drill 1.016 pad 1.88: 1 -7.62,12.7; 2 -7.62,10.16; 3 -7.62,7.62; 4 -7.62,5.08; 5 -7.62,2.54; 6 -7.62,0; 7 -7.62,-2.54; 8 -7.62,-5.08; 9 -7.62,-7.62; 10 -7.62,-10.16; 11 -7.62,-12.7; 12 -7.62,-15.24; 13 7.62,-15.24; 14 7.62,-12.7; 15 7.62,-10.16; 16 7.62,-7.62; 17 7.62,-5.08; 18 7.62,-2.54; 19 7.62,0; 20 7.62,2.54; 21 7.62,5.08; 22 7.62,7.62; 23 7.62,10.16; 24 7.62,12.7; A4 4.763,1.429; A5 4.763,3.969; A6 4.763,-9.049; A7 4.763,-6.509; BLK -6.35,15.24; GND -3.81,15.24; GRN 6.35,15.24; RXI 1.27,15.24; TXO 3.81,15.24; VCC -1.27,15.24
C2.5-5 = drill 0.813 pad 1.6 octagon: 1 -1.27,0; 2 1.27,0
CPOL-RADIAL-2.5MM-5MM = drill 0.7 pad 1.651 square: 1 1.25,0 | drill 0.7 pad 1.651: 2 -1.25,0
CPOL-RADIAL-2.5MM-6.5MM = drill 0.7 pad 1.651 square: 1 1.25,0 | drill 0.7 pad 1.651: 2 -1.25,0
C2.5-3 = drill 0.813 pad 1.6 octagon: 1 -1.27,0; 2 1.27,0
WQP-PJ301M-12_JACK = drill 1.1: P$1_TIP 0,5; P$2_SWITCH 0,-3.5; P$3_SLEEVE 0,-6.5
DO41-10 = drill 1.118 pad 1.93: A 5.08,0; C -5.08,0
LED_3MM = drill 0.813 pad 1.88: A -1.27,0; K 1.27,0
FB = drill 0.8 pad 1.93: P$1 -2.5,0; P$2 2.5,0
1X13 = drill 1.016 pad 1.88: 1 0,0; 2 2.54,0; 3 5.08,0; 4 7.62,0; 5 10.16,0; 6 12.7,0; 7 15.24,0; 8 17.78,0; 9 20.32,0; 10 22.86,0; 11 25.4,0; 12 27.94,0; 13 30.48,0
1X14 = drill 1.016 pad 1.88: 1 0,0; 2 2.54,0; 3 5.08,0; 4 7.62,0; 5 10.16,0; 6 12.7,0; 7 15.24,0; 8 17.78,0; 9 20.32,0; 10 22.86,0; 11 25.4,0; 12 27.94,0; 13 30.48,0; 14 33.02,0
1X09 = drill 1.016 pad 1.88: 1 0,0; 2 2.54,0; 3 5.08,0; 4 7.62,0; 5 10.16,0; 6 12.7,0; 7 15.24,0; 8 17.78,0; 9 20.32,0
1X06_NO_SILK = drill 1.016 pad 1.88: 1 0,0; 2 2.54,0; 3 5.08,0; 4 7.62,0; 5 10.16,0; 6 12.7,0
1X07 = drill 1.016 pad 1.88: 1 0,0; 2 2.54,0; 3 5.08,0; 4 7.62,0; 5 10.16,0; 6 12.7,0; 7 15.24,0
EURO_POWER_HEADER = drill 1.016 octagon: 1 -5.08,-1.27; 2 -5.08,1.27; 3 -2.54,-1.27; 4 -2.54,1.27; 5 0,-1.27; 6 0,1.27; 7 2.54,-1.27; 8 2.54,1.27; 9 5.08,-1.27; 10 5.08,1.27
AXIAL-0.3 = drill 0.9 pad 1.88: P$1 -3.81,0; P$2 3.81,0
SUBMINI_TOGGLE = drill 1 pad 1.422: 1 -2.54,0; 3 2.54,0; COM 0,0
TOUCH_PAD_ESSY = drill 0.6 square: P$1 -1.27,-2.54
DIL08 = drill 0.813 pad 1.27 long: 1 -3.81,-3.81; 2 -1.27,-3.81; 3 1.27,-3.81; 4 3.81,-3.81; 5 3.81,3.81; 6 1.27,3.81; 7 -1.27,3.81; 8 -3.81,3.81
DIL14 = drill 0.813 long: 1 -7.62,-3.81; 2 -5.08,-3.81; 3 -2.54,-3.81; 4 0,-3.81; 5 2.54,-3.81; 6 5.08,-3.81; 7 7.62,-3.81; 8 7.62,3.81; 9 5.08,3.81; 10 2.54,3.81; 11 0,3.81; 12 -2.54,3.81; 13 -5.08,3.81; 14 -7.62,3.81
TOUCH_PAD_INCREMENT = drill 0.6 square: P$1 -2.032,0
EURO_PANEL_SCREW_HOLE = hole 3.2: -0.032,0.032
9MM_SNAP-IN_POT = drill 1.1 square: 1 -2.5,-7 | drill 1.1 octagon: 2 0,-7; 3 2.5,-7 | drill 2.1 pad 2.794: CHASSIS1 -4.5,0; CHASSIS2 4.5,0

### Placement (x,y rotation side)
B1  25.4,25.4 270 top
C1  72.71,12.7 0 top
C5  76.2,5.08 180 top
C6  96.52,29.21 270 top
C7  52.07,25.72 0 top
C8  63.5,37.78 180 top
C9  54.61,13.97 90 top
C10  105.41,29.21 90 top
CV_INPUT  111.76,76.2 90 top
CV_OUT  111.76,55.88 90 top
D1  86.36,33.02 270 top
D2  116.84,33.02 270 top
D3  10.16,73.66 0 top
D4  20.32,73.66 0 top
D5  30.48,73.66 0 top
D6  40.64,73.66 0 top
D7  50.8,73.66 0 top
D8  60.96,73.66 0 top
D9  71.12,73.66 0 top
D10  81.28,73.66 0 top
D11  101.6,66.04 0 top
FERRITE_1  111.76,35.56 90 top
FERRITE_2  91.44,35.56 90 top
GATE_OUT  111.76,66.04 90 top
J1  86.36,45.72 0 top
J2  86.36,2.54 0 top
J3  10.16,38.1 0 top
J4  10.16,81.28 0 top
J5  30.48,12.7 180 top
J6  10.16,55.88 0 top
MCP4725  38.1,5.08 0 top
MPR121  109.22,22.86 180 top
MPR121_TOUCH_PINS  86.36,7.62 0 top
POWER  101.6,35.56 180 top
R1  13.97,66.04 0 top
R2  15.24,73.66 270 top
R3  25.4,73.66 270 top
R4  35.56,73.66 270 top
R5  45.72,73.66 270 top
R6  55.88,73.66 270 top
R7  66.04,73.66 270 top
R8  76.2,73.66 270 top
R9  52.07,17.78 0 top
R10  52.07,20.32 180 top
R11  52.07,31.75 180 top
R12  52.07,34.29 180 top
R13  81.28,60.96 180 top
R14  74.93,20.32 180 top
R15  81.28,66.04 0 top
R16  81.28,63.5 0 top
R17  74.93,34.29 0 top
R18  74.93,26.67 0 top
R19  52.07,29.21 0 top
R20  74.93,29.21 0 top
R21  74.93,31.75 180 top
R22  40.64,65.41 180 top
R23  40.64,61.59 0 top
SW1  30.48,63.5 0 top
SW2  50.8,63.5 0 top
SW3  60.96,63.5 0 top
SW4  71.12,63.5 0 top
SW5_MODE  91.44,63.5 270 top
TOUCH_1  81.28,48.26 0 top
TOUCH_2  71.12,48.26 0 top
TOUCH_3  60.96,48.26 0 top
TOUCH_4  50.8,48.26 0 top
TOUCH_5  40.64,48.26 0 top
TOUCH_6  30.48,48.26 0 top
TOUCH_7  20.32,48.26 0 top
TOUCH_8  10.16,48.26 0 top
U3  63.5,30.48 270 top
U4  63.5,12.7 270 top
U$1  99.06,53.34 0 top
U$2  91.44,53.34 180 top
U$3  [EURO_PANEL_SCREW_HOLE]  3.04,50.8 0 top
U$4  [EURO_PANEL_SCREW_HOLE]  124.46,50.8 0 top
VR1  93.98,76.2 270 top

### Tracks (layer width: path | path; a pad name or v marks a point on that pad's centre or on a via)
5V  (via drill 0.35)  (1 unrouted)
  Top 0.152: v43.18,13.97 42.55,14.61 31.75,14.61 30.48,15.88 B1.21 30.48,19.05 31.75,20.32 32.38,20.32 33.02,20.95 v33.02,30.48 | MPR121.7 93.98,17.78 91.44,15.24 83.19,15.24 82.55,14.61 v82.55,13.97 | v82.55,10.79 82.55,3.81 83.82,2.54 J2.1 | v83.19,52.39 v83.19,56.83
  Bottom 0.152: v43.18,13.97 MCP4725.3 | 64.77,36.2 57.15,36.2 56.52,36.83 56.52,38.1 55.88,38.73 47.62,38.73 46.35,37.47 46.35,36.2 45.72,35.56 43.81,35.56 42.55,34.29 42.55,31.11 41.91,30.48 38.1,30.48 37.47,29.84 36.2,29.84 35.56,30.48 v33.02,30.48 | 64.77,36.2 66.67,36.2 | 66.67,36.2 67.31,35.56 U3.8 | 78.74,38.1 68.58,38.1 66.67,36.2 | R17.P$2 78.74,38.1 | 78.74,38.1 83.19,38.1 83.82,37.47 83.82,27.3 85.09,26.04 87.63,26.04 88.27,26.67 92.08,26.67 93.98,25.4 MPR121.7 | v82.55,10.79 v82.55,13.97 | J1.1 86.36,48.26 85.09,49.53 85.09,51.75 84.77,52.07 84.14,52.07 83.82,52.39 v83.19,52.39 | 63.5,60.96 73.03,60.96 73.66,61.59 SW4.3 73.66,66.04 75.56,67.94 78.74,67.94 79.38,67.31 79.38,62.23 83.19,58.42 v83.19,56.83 | 63.5,60.96 60.33,60.96 59.69,61.59 53.34,61.59 | 53.34,61.59 46.99,61.59 45.09,63.5 SW1.3 | SW2.3 53.34,61.59 | SW3.3 63.5,60.96 | 64.77,36.2 C8.1
+12V  (via drill 0.35)  (1 unrouted)
  Top 0.152: v36.83,31.11 36.83,21.59 38.1,20.32 B1.24 38.1,16.51 38.73,15.88 45.72,15.88 47.62,13.97 48.9,13.97 50.16,12.7 C9.1 U4.4
  Bottom 0.152: 96.52,27.94 91.44,27.94 88.9,30.48 88.9,38.1 D1.C 84.45,39.37 46.99,39.37 45.72,38.1 45.72,36.83 45.09,36.2 38.1,36.2 36.83,34.29 v36.83,31.11
+VCC  (1 unrouted)
  Top 0.152: POWER.10 POWER.9 96.52,37.47 95.89,38.1 91.44,38.1
-12V  (1 unrouted)
  Top 0.152: 105.41,27.94 D2.A 116.84,13.97 115.57,12.7 82.55,12.7 80.64,10.79 72.39,10.79 71.44,11.75 C1.1 U4.11
-VCC  (1 unrouted)
  Top 0.152: POWER.2 POWER.1 109.86,36.83 111.76,38.1
CV_IN
  Bottom 0.152: B1.18 22.86,25.4 25.4,27.94 43.18,27.94 43.81,28.57 43.81,30.48 45.72,32.38 45.72,34.29 46.99,35.56 54.61,35.56 R12.P$1 U3.1
CV_INPUT
  Top 0.152: R9.P$1 46.35,17.78 44.45,19.68 44.45,26.04 43.18,27.3 43.18,34.29 42.55,34.92 38.73,34.92 38.1,35.56 J3.12
CV_OUT
  Top 0.152: J5.2 27.94,3.17 28.57,2.54 62.87,2.54 63.5,3.17 63.5,4.45 64.14,5.08 U4.8 U4.9
GATE  (via drill 0.35)
  Top 0.152: B1.19 25.4,15.88 26.04,15.24 30.48,15.24 31.75,13.97 41.91,13.97 44.45,11.43 62.87,11.43 63.5,12.06 63.5,14.61 64.14,15.24 | 64.14,15.24 U4.12 | 64.14,15.24 65.41,16.51 80.64,16.51 81.28,17.14 v81.28,24.13
  Bottom 0.152: v81.28,24.13 81.28,28.57 80.64,29.21 R20.P$2
GATE_LED  (via drill 0.35)
  Top 0.152: v39.37,8.89 v50.8,8.89 | v33.66,8.89 31.11,8.89 30.48,9.53 J5.1
  Bottom 0.152: v50.8,8.89 55.88,8.89 56.52,9.53 56.52,15.24 57.78,16.51 61.59,16.51 62.23,17.14 62.23,18.41 62.87,19.05 69.85,19.05 70.48,18.41 74.93,18.41 75.56,19.05 75.56,19.68 76.2,20.32 R14.P$1 | v33.66,8.89 v39.37,8.89
GATE_OUT  (via drill 0.35)
  Top 0.152: v82.55,20.32 83.19,20.95 84.45,20.95 85.09,21.59 85.09,23.5 84.45,24.13 v83.82,24.13
  Bottom 0.152: J5.3 25.4,8.26 26.04,7.62 31.11,7.62 31.75,6.99 31.75,5.08 35.56,1.27 80.64,1.27 81.28,1.91 81.28,10.79 81.92,11.43 81.92,13.34 81.28,13.97 81.28,14.61 82.55,15.88 v82.55,20.32 | v83.82,24.13 83.19,24.13 82.55,24.77 82.55,31.11 81.92,31.75 R21.P$1
GLIDE_1  (via drill 0.35)  (1 unrouted)
  Top 0.152: J3.10 33.02,35.56 31.75,34.29 v31.75,22.86
  Bottom 0.152: v31.75,22.86 31.75,15.88 33.02,15.24 33.02,10.16 32.38,9.53 32.38,8.89 33.02,8.26 33.02,5.08 36.2,1.91 67.94,1.91 71.12,5.08 | 71.12,5.08 71.12,9.53 70.48,10.16 U4.10 | 71.12,5.08 74.93,5.08
GLIDE_3  (via drill 0.35)
  Top 0.152: 35.56,37.47 J3.11 35.56,35.56 34.29,34.29 v34.29,22.86 | U4.6 U4.7 56.52,5.08 55.88,4.45 55.88,3.81 55.24,3.17 35.56,3.17 34.92,3.81 34.92,11.43 34.29,12.06 v34.29,12.7
  Bottom 0.152: v34.29,12.7 v34.29,22.86
GND  (via drill 0.35)  (8 unrouted)
  Top 0.152: B1.4 J3.9 | POWER.4 POWER.3 POWER.7 POWER.8 | POWER.5 POWER.6 | POWER.4 POWER.6 | POWER.6 POWER.8 | 105.41,30.48 105.41,32.38 POWER.4 | 96.52,30.48 96.52,31.75 POWER.8 | U3.3 U3.4 62.87,26.67 | POWER.6 101.6,26.67 100.97,26.04 99.06,26.04 | MPR121.5 99.06,26.04 | 99.06,26.04 91.44,26.04 89.53,24.77 85.09,24.77 84.45,25.4 80.64,25.4 80.01,24.77 79.38,24.77 78.74,25.4 | 63.5,24.77 63.5,26.04 62.87,26.67 | 63.5,24.77 63.5,15.88 62.87,15.24 62.23,15.24 | 62.23,15.24 U4.3 C9.2 | 62.87,26.67 63.5,27.3 63.5,33.66 62.23,34.92 C8.2 | 78.74,25.4 R18.P$2 | 63.5,24.77 78.11,24.77 78.74,25.4 | v62.23,13.97 62.23,15.24 | v40.64,7.62 v49.53,7.62
  Bottom 0.152: MCP4725.2 v40.64,7.62 40.64,10.16 35.56,15.24 B1.23 | v62.23,13.97 73.66,13.97 73.98,13.65 C1.2 73.98,8.57 74.61,7.94 76.2,7.94 77.47,6.67 77.47,5.08 | D3.K 15.88,73.66 17.78,71.75 20.95,71.75 21.59,72.39 D4.K 26.67,73.66 29.21,71.12 | 29.21,71.12 31.11,71.12 31.75,71.75 D5.K | D5.K 36.2,73.66 36.83,73.03 36.83,71.12 37.47,70.48 41.27,70.48 41.91,71.12 D6.K 45.72,73.66 47.62,71.75 | D5.K 31.75,78.74 30.48,80.01 J4.9 | 47.62,71.75 51.44,71.75 52.07,72.39 D7.K 57.15,73.66 59.69,71.12 | 59.69,71.12 61.59,71.12 62.23,71.75 D8.K 67.31,73.66 69.22,71.75 | 69.22,71.75 71.75,71.75 72.39,72.39 D9.K 77.47,73.66 78.74,72.39 78.74,71.75 79.38,71.12 81.92,71.12 82.55,71.75 | 82.55,71.75 D10.K | 29.21,71.12 28.57,70.48 28.57,65.41 27.94,64.77 SW1.1 | 47.62,71.75 47.62,65.41 48.26,64.77 SW2.1 | 59.69,71.12 58.42,69.85 SW3.1 | 69.22,71.75 69.22,68.58 68.58,67.94 SW4.1 | 82.55,71.75 85.72,71.75 87.63,69.85 | 87.63,69.85 SW5_MODE.1 | 87.63,69.85 92.08,69.85 92.71,69.22 97.16,69.22 99.06,71.12 102.87,71.12 | 102.87,71.12 116.84,71.12 | 116.84,71.12 118.11,72.39 118.11,76.2 | 116.84,71.12 118.11,69.85 118.11,55.88 | 102.87,71.12 D11.K | C9.2 52.07,15.24 49.53,12.7 v49.53,7.62
LED_I
  Top 0.152: B1.12 J3.1
LED_II
  Top 0.152: B1.11 J3.2
LED_III
  Top 0.152: B1.10 J3.3
LED_IV
  Top 0.152: B1.9 J3.4
LED_V
  Top 0.152: B1.8 J3.5
LED_VI
  Top 0.152: B1.7 J3.6
LED_VII
  Top 0.152: B1.6 J3.7
LED_VIII
  Top 0.152: B1.5 J3.8
N$1  (1 unrouted)
  Top 0.152: 111.76,33.02 113.67,33.02 114.3,33.66 114.3,35.56 D2.C
N$2
  Top 0.152: R21.P$2 U3.7
  Bottom 0.152: U3.7 65.41,31.75 64.14,30.48 51.44,30.48 50.16,29.21 R19.P$1 48.26,27.3 49.85,25.72 C7.1
N$3  (1 unrouted)
  Top 0.152: D1.A 88.9,27.94 91.44,30.48 91.44,33.02
N$4
  Top 0.152: R23.P$1 31.11,61.59 30.48,62.23 SW1.COM
N$5
  Top 0.152: R1.P$1 10.16,71.12 8.89,72.39 D3.A
N$6
  Top 0.152: R22.P$1 50.16,65.41 50.8,64.77 SW2.COM
N$7
  Top 0.152: R16.P$1 76.2,63.5 74.3,61.59 61.59,61.59 60.96,62.23 SW3.COM
N$8
  Top 0.152: R15.P$1 75.56,66.04 74.93,65.41 71.75,65.41 71.12,64.77 SW4.COM
N$10
  Top 0.152: U4.13 U4.14 R14.P$2
N$13
  Top 0.152: R8.P$1 79.38,77.47 80.01,76.83 D10.A
N$14
  Top 0.152: R7.P$1 69.22,77.47 69.85,76.83 D9.A
N$15
  Top 0.152: R6.P$1 59.05,77.47 59.69,76.83 D8.A
N$16
  Top 0.152: R5.P$1 48.9,77.47 49.53,76.83 D7.A
N$17
  Top 0.152: R4.P$1 38.73,77.47 39.37,76.83 D6.A
N$18
  Top 0.152: R3.P$1 27.94,77.47 29.21,76.2 D5.A
N$19
  Top 0.152: R2.P$1 17.14,77.47 17.78,76.83 17.78,74.93 D4.A
N$20
  Top 0.152: U3.6 R20.P$1
  Bottom 0.152: U3.6 65.41,29.21 64.14,27.94 58.42,27.94 | 58.42,27.94 57.15,29.21 R19.P$2 | C7.2 56.2,25.72 58.42,27.94
N$24
  Top 0.152: U4.2 R9.P$2 53.34,17.78 50.8,20.32 R10.P$2
N$27
  Top 0.152: R13.P$1 87.63,60.96 90.17,63.5 SW5_MODE.COM
N$28
  Top 0.152: U4.1 R10.P$1 52.07,20.32 49.53,22.86 45.72,22.86 45.09,23.5 45.09,30.48 46.35,31.75 R11.P$2
N$29
  Top 0.152: U3.2 R11.P$1 53.34,31.75 50.8,33.02 50.8,33.66 50.16,34.29 R12.P$2
N$30
  Top 0.152: U3.5 R18.P$1 73.03,26.67 73.66,27.3 73.66,33.66 73.03,34.29 R17.P$1
N$32  (via drill 0.35)
  Top 0.152: v38.1,76.2 37.47,75.56 33.66,75.56 29.84,79.38 28.57,79.38 27.94,80.01 J4.8 | R8.P$2 69.22,69.85 67.31,71.75 57.78,71.75 57.15,72.39 54.61,72.39 53.34,71.12 49.53,71.12 47.62,73.03 44.45,73.03 43.81,73.66 43.81,74.93 42.55,76.2 v41.27,76.2
  Bottom 0.152: v38.1,76.2 v41.27,76.2
N$33
  Top 0.152: R7.P$2 58.42,69.85 56.52,71.75 55.24,71.75 53.98,70.48 49.53,70.48 47.62,72.39 43.81,72.39 43.18,71.75 38.73,71.75 37.47,73.03 35.56,73.03 29.84,78.74 27.3,78.74 25.4,80.64 J4.7
N$35
  Top 0.152: J4.6 22.86,80.64 24.13,79.38 25.4,79.38 26.04,78.74 26.67,78.74 27.3,78.11 29.84,78.11 35.56,72.39 37.47,72.39 38.73,71.12 43.81,71.12 44.45,71.75 46.99,71.75 48.9,69.85 R6.P$2
  Bottom 0.152: J4.6 22.86,80.01
N$36
  Top 0.152: J4.5 20.95,80.64 20.95,78.74 24.13,75.56 26.67,75.56 27.3,74.93 27.3,72.39 27.94,71.75 37.47,71.75 39.37,69.85 R5.P$2
N$40
  Top 0.152: R4.P$2 28.57,69.85 26.04,72.39 26.04,74.3 25.4,74.93 22.86,74.93 17.78,80.01 J4.4
N$41
  Top 0.152: J4.3 15.24,79.38 14.61,78.74 13.97,78.74 13.34,78.11 13.34,76.83 13.97,76.2 17.14,73.66 17.14,71.12 18.41,69.85 R3.P$2
N$42
  Top 0.152: J4.2 12.7,76.2 15.24,73.66 R2.P$2
N$43
  Top 0.152: R1.P$2 13.34,66.04 12.7,66.67 12.7,75.56 10.16,78.11 J4.1
QUANTIZED_CV
  Top 0.152: U4.5 38.73,10.16 38.1,9.53 MCP4725.1
SCL  (1 unrouted)
  Bottom 0.152: 29.21,20.32 29.21,23.5 29.84,24.13 35.56,24.13 36.83,22.86 41.91,22.86 42.55,22.23 | 42.55,22.23 42.55,20.32 45.09,17.78 45.09,14.61 46.35,13.34 47.62,13.34 48.26,12.7 MCP4725.5 | 42.55,22.23 43.81,23.5 50.16,23.5 50.8,22.86 66.04,22.86 66.67,22.23 89.53,22.23 91.44,20.32 106.05,20.32 106.68,20.95 MPR121.2
SDA  (via drill 0.35)  (1 unrouted)
  Top 0.152: v43.18,17.78 v43.18,25.4 | v91.44,24.13 92.08,24.77 v95.25,24.77
  Bottom 0.152: MCP4725.4 45.72,12.7 43.18,15.24 v43.18,17.78 | 26.67,20.32 26.67,24.13 27.94,25.4 v43.18,25.4 45.72,25.4 46.99,24.13 66.04,24.13 67.31,22.86 89.53,22.86 v91.44,24.13 | v95.25,24.77 103.5,24.77 104.14,24.13 MPR121.3
SW1
  Top 0.152: J5.9 B1.13
SW2
  Top 0.152: B1.14 J5.8
SW3
  Top 0.152: J5.7 B1.15
SW4
  Top 0.152: B1.16 J5.6
SW_MODE
  Top 0.152: J5.5 B1.17
TO_CV_INPUT  (1 unrouted)
  Top 0.152: J4.12 38.1,80.64 39.37,79.38 47.62,79.38 48.9,80.64 89.53,80.64 92.08,78.11 103.5,78.11 105.41,76.2 106.68,76.2
TO_CV_OUT  (via drill 0.35)  (1 unrouted)
  Top 0.152: v76.2,57.15 81.28,57.15 81.92,57.78 84.45,57.78 85.09,57.15 104.14,57.15 105.41,55.88 106.68,55.88
  Bottom 0.152: J6.2 12.7,54.61 13.34,53.98 45.72,53.98 48.9,57.15 55.88,57.15 56.52,57.78 59.69,57.78 60.33,57.15 v76.2,57.15
TO_GATE_LED
  Top 0.152: D11.A 93.34,59.05 79.38,59.05 78.74,58.42 48.26,58.42 43.18,53.34 10.79,53.34 10.16,53.98 J6.1
TO_GATE_OUT  (1 unrouted)
  Top 0.152: J6.3 15.24,58.42 24.13,67.31 34.92,67.31 35.56,67.94 45.72,67.94 46.35,67.31 75.56,67.31 76.83,68.58 104.14,68.58 106.68,66.04
TO_GLIDE_1  (1 unrouted)
  Top 0.152: J4.10 33.02,80.01 34.29,78.74 87,78.74
TO_GLIDE_3  (2 unrouted)
  Bottom 0.152: J4.11 35.56,80.01 37.47,78.11 42.55,78.11 45.09,75.56 57.78,75.56 58.42,76.2 64.14,76.2 64.77,75.56 78.74,75.56 79.38,76.2 87,76.2 87,73.66
TO_SW1
  Top 0.152: J6.9 40.64,55.88 44.45,59.69 R23.P$2
TO_SW2
  Top 0.152: J6.8 27.94,57.15 28.57,57.78 37.47,57.78 39.37,59.69 39.37,64.77 38.73,65.41 R22.P$2
TO_SW3
  Top 0.152: J6.7 27.3,53.98 40.64,53.98 46.99,60.33 74.3,60.33 75.56,59.05 78.74,59.05 79.38,59.69 79.38,60.33 82.55,63.5 R16.P$2
TO_SW4
  Top 0.152: R15.P$2 83.19,66.04 81.28,67.94 76.83,67.94 75.56,66.67 45.72,66.67 45.09,67.31 36.2,67.31 35.56,66.67 26.04,66.67 22.86,63.5 J6.6
TO_SW5_MODE
  Bottom 0.152: J6.5 20.32,57.15 22.23,59.05 75.56,59.05 R13.P$2
TO_TOUCH0
  Bottom 0.152: J1.2 87,47.62 87,51.44 85.72,52.7 84.45,52.7 83.82,53.34 77.47,53.34 76.2,52.07 76.2,45.09 75.56,44.45 9.53,44.45 8.89,45.09 TOUCH_8.P$1
TO_TOUCH1  (via drill 0.35)
  Top 0.152: v58.42,52.7 57.78,52.7 57.15,52.07 57.15,45.72 55.88,44.45 20.32,44.45 20,44.77 19.37,44.77 19.05,45.09 TOUCH_7.P$1
  Bottom 0.152: J1.3 91.44,48.9 87.63,52.7 87.63,53.34 87,53.98 60.33,53.98 59.05,52.7 v58.42,52.7
TO_TOUCH2
  Bottom 0.152: J1.4 93.98,52.07 94.61,52.7 94.61,53.98 92.71,55.88 88.9,55.88 87.63,54.61 59.69,54.61 59.05,53.98 55.88,53.98 53.34,51.44 27.3,51.44 26.67,50.8 26.67,46.35 27.3,45.72 TOUCH_6.P$1
TO_TOUCH3  (via drill 0.35)
  Top 0.152: v50.8,55.88 48.9,55.88 45.09,52.07 38.1,52.07 36.83,50.8 36.83,46.35 37.47,45.72 TOUCH_5.P$1
  Bottom 0.152: J1.5 96.52,51.44 95.25,52.7 95.25,53.98 92.71,56.52 88.9,56.52 87.63,55.24 59.69,55.24 59.05,54.61 56.52,54.61 55.24,55.88 v50.8,55.88
TO_TOUCH4  (via drill 0.35)
  Top 0.152: v58.42,55.88 55.88,53.34 55.88,45.72 55.24,45.09 50.8,45.09 50.48,44.77 49.85,44.77 49.53,45.09 TOUCH_4.P$1
  Bottom 0.152: J1.6 99.06,51.44 98.42,52.07 96.52,52.07 95.89,52.7 95.89,54.61 92.71,57.78 86.36,57.78 84.45,55.88 v58.42,55.88
TO_TOUCH5
  Top 0.152: J1.7 101.6,49.53 86.36,49.53 85.09,48.26 85.09,46.99 82.55,44.45 60.01,44.45 59.69,44.77 TOUCH_3.P$1
TO_TOUCH6
  Top 0.152: J1.8 104.14,50.16 86.36,50.16 84.45,48.26 84.45,46.99 82.23,44.77 77.47,44.77 77.15,45.09 71.12,45.09 70.48,45.72 TOUCH_2.P$1
TO_TOUCH7
  Top 0.152: J1.9 106.68,50.8 86.36,50.8 85.72,51.44 78.74,51.44 78.11,50.8 78.11,46.35 78.74,45.72 TOUCH_1.P$1
TO_TOUCH8  (via drill 0.35)  (1 unrouted)
  Top 0.152: v105.41,53.98 102.87,56.52 95.25,56.52 93.66,54.93 93.66,53.66
  Bottom 0.152: J1.10 109.22,50.16 v105.41,53.98
TO_TOUCH9  (1 unrouted)
  Top 0.152: J1.11 111.76,50.8 109.86,52.7 104.78,52.7 101.6,55.88 99.69,55.88 98.42,54.61 97.47,54.61 97.16,54.29 97.16,53.66
TOUCH0
  Top 0.152: J2.2 MPR121_TOUCH_PINS.2
TOUCH1
  Top 0.152: J2.3 MPR121_TOUCH_PINS.3
TOUCH2
  Top 0.152: J2.4 MPR121_TOUCH_PINS.4
TOUCH3
  Top 0.152: J2.5 MPR121_TOUCH_PINS.5
TOUCH4
  Top 0.152: J2.6 MPR121_TOUCH_PINS.6
TOUCH5
  Top 0.152: J2.7 MPR121_TOUCH_PINS.7
TOUCH6
  Top 0.152: J2.8 MPR121_TOUCH_PINS.8
TOUCH7
  Top 0.152: J2.9 MPR121_TOUCH_PINS.9
TOUCH8
  Top 0.152: J2.10 MPR121_TOUCH_PINS.10
TOUCH9
  Top 0.152: J2.11 MPR121_TOUCH_PINS.11
TOUCH10
  Top 0.152: J2.12 MPR121_TOUCH_PINS.12
TOUCH11
  Top 0.152: J2.13 MPR121_TOUCH_PINS.13

### Text on the board
tSilk: ESSY Quant V1
_tsilk: IN | VI | VII | I | IV | V | II | III | GATE | MODE | OUT | Octave - | Octave + | MPR121 | MPC4725